# EAGLE design SOIL (EAGLE 9.6.2)
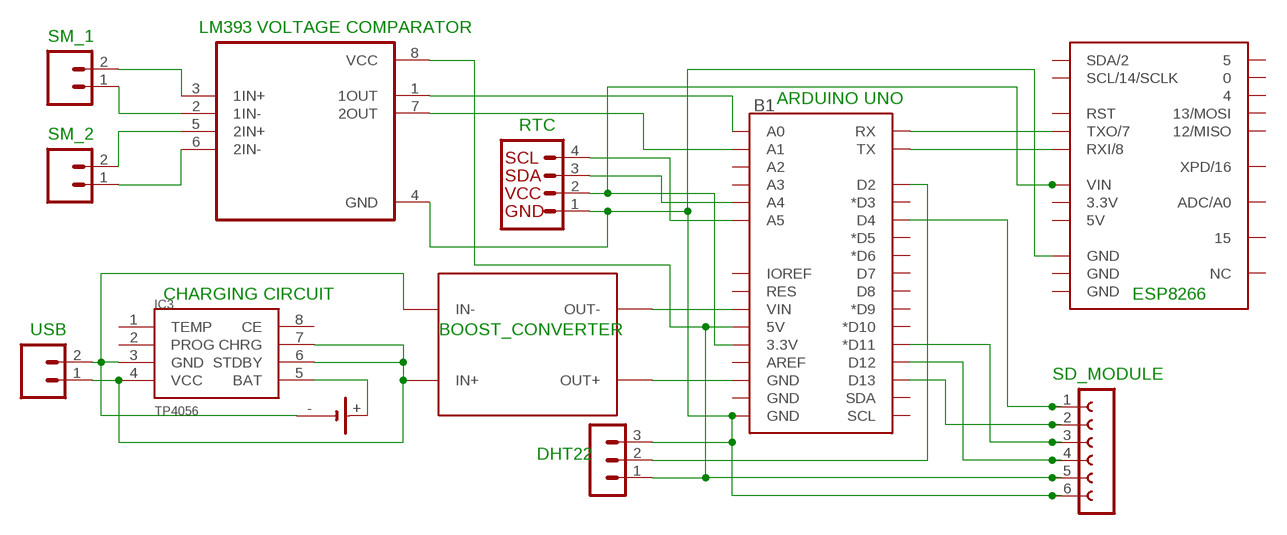
[diagram p0: schematic, sheet 1]

## Parts
B1  ARDUINO_UNO_R3_SHIELDUNO_R3_SHIELD_NOLABELS_LOCK  [UNO_R3_SHIELD_NOLABELS_LOCK]
B2  SPARKFUN_ESP8266_THING_DEV  [SPARKFUN_ESP8266_THING_DEV]
G1  SL-150-1/2AA/PT  [SL-150-1/2AA/PT]
IC3  TP4056  [SOP-8]
J3  CONN_02  [1X02]
J4  I2C_STANDARDUNITEST  [1X04_UNITEST]
J5  CONN_02  [1X02]
J6  CONN_02  [1X02]
SV3  MA03-1  [MA03-1]
SV4  FE06-1  [FE06]
U1  LM393D  [SOIC127P600X175-8N]
U$1  DC-DC-STEP-UP-MT3608  [DC-DC-STEP-UP-MT3608]

## Nets
N$1: B1.VIN U$1.OUT-
N$2: B1.GND@2(GND) U$1.OUT+
N$3: G1.- IC3.3(GND) J5.2 U$1.IN-
N$4: IC3.4(VCC) IC3.6(STDBY) IC3.7(CHRG) J5.1 U$1.IN+
N$5: G1.+ IC3.5(BAT)
N$6: J6.2 U1.3(1IN+)
N$7: B1.D4 SV4.1
N$8: B1.D13 SV4.2
N$9: B1.D11(*D11) SV4.3
N$10: B1.D12 SV4.4
N$11: B1.5V SV3.1 SV4.5 U1.8(VCC)
N$12: B1.GND@0(GND) B2.GND@1(GND) J4.1 SV3.3 SV4.6 U1.4(GND)
N$13: B1.A5 J4.4
N$14: B1.A4 J4.3
N$15: B1.3.3V B2.VIN J4.2
N$16: B1.RX B2.TX(TXO/7)
N$17: B1.TX B2.RX(RXI/8)
N$18: B1.D2 SV3.2
N$19: J6.1 U1.2(1IN-)
N$20: B1.A1 U1.7(2OUT)
N$21: B1.A0 U1.1(1OUT)
N$22: J3.2 U1.5(2IN+)
N$23: J3.1 U1.6(2IN-)
Unconnected: B1.A2 B1.A3 B1.AREF B1.D3(*D3) B1.D5(*D5) B1.D6(*D6) B1.D7 B1.D8 B1.D9(*D9) B1.D10(*D10) B1.GND@1(GND) B1.IOREF B1.RES B1.SCL B1.SDA B2.0 B2.2(SDA/2) B2.4 B2.5 B2.12(12/MISO) B2.13(13/MOSI) B2.14(SCL/14/SCLK) B2.15 B2.16(XPD/16) B2.ADC(ADC/A0) B2.NC B2.RST G1.-@1(-) IC3.1(TEMP) IC3.2(PROG) IC3.8(CE)

## Notes on the sheet
- LM393 VOLTAGE COMPARATOR
- SM_1
- ARDUINO UNO
- RTC
- SM_2
- CHARGING CIRCUIT | ESP8266
- USB | BOOST_CONVERTER
- SD_MODULE
- DHT22

## Power pins joined to a net without a drawn wire
3.3V: B2.3.3V
5V: B2.5V
GND: B2.GND@2(GND) B2.GND@3(GND)

## Library data of the parts
B1 = SparkFun-Boards:ARDUINO_UNO_R3_SHIELD: Arduino R3 Shield Footprint Shield form compatible with the Arduino Uno R3. SparkFun Products: MG2639 Cellular Shield <https://www.sparkfun.com/products/13120> MIDI Shield <https://www.sparkfun.com/products/12898> R3 Stackable Headers Kit <https://www.sparkfun.com/products/11417>
B2 = SparkFun-Boards:SPARKFUN_ESP8266_THING_DEV: SparkFun Thing -Dev Board The SparkFun ESP8266 Thing Dev is a breakout and development board for the ESP8266 WiFi SoC, with an integrated FTDI USB-to-Serial chip. SparkFun Products: SparkFun ESP8266 Thing-Dev Board <https://www.sparkfun.com/products/13711>; SF_ID: WRL-13711
G1 = battery:SL-150-1/2AA/PT: LI BATTERY Sonnenschein
IC3 = TP4056:TP4056
J3 J5 J6 = SparkFun-Connectors:CONN_02: Multi connection point. Often used as Generic Header-pin footprint for 0.1 inch spaced/style header connections On any of the 0.1 inch spaced packages, you can populate with these: Break Away Headers - Straight <https://www.sparkfun.com/products/116> (PRT-00116) Break Away Male Headers - Right Angle <https://www.sparkfun.com/products/553> (PRT-00553) Female Headers <https://www.sparkfun.com/products/115> (PRT-00115) Break Away Headers - Machine Pin <https://www.sparkfun.com/products/117> (PRT-00117) Break Away Female Headers - Swiss Machine Pin <https://www.sparkfun.com/products/743> (PRT-00743) For SCREWTERMINALS and SPRING TERMINALS visit here: Screw Terimnals on SparkFun.com <https://www.sparkfun.com/search/results?term=Screw+Terminals> (5mm/3.5mm/2.54mm spacing) This device is also useful as a general connection point to wire up your design to another part of your project. Our various solder wires solder well into these plated through hole pads. Hook-Up Wire - Assortment (Stranded, 22 AWG) <https://www.sparkfun.com/products/11375> (PRT-11375) Hook-Up Wire - Assortment (Solid Core, 22 AWG) <https://www.sparkfun.com/products/11367> (PRT-11367) View the entire wire category on our website here <https://www.sparkfun.com/categories/141> Special notes: Molex polarized connector foot print use with: PRT-08233 with associated crimp pins and housings. 2.54_SCREWTERM for use with PRT-10571. 3.5mm Screw Terminal footprints for PRT-08084 5mm Screw Terminal footprints for use with PRT-08432
J4 = SparkFun-Connectors:I2C_STANDARD: SparkFun I2C Standard Pinout Header SparkFun has standardized on a pinout for all I2C based sensor breakouts. This pinout allows I2C boards to be plugged directly into the headers on Arduino Uno compatible boards, and to be daisy chained easily. Example SparkFun Products: SparkFun Atmospheric Sensor Breakout - BME280 <https://www.sparkfun.com/products/13676> SparkFun Altitude/Pressure Sensor Breakout - MPL3115A2 <https://www.sparkfun.com/products/11084> SparkFun TOF Range Finder Sensor - VL6180 <https://www.sparkfun.com/products/12785>
SV3 = con-lstb:MA03-1: PIN HEADER; OC_FARNELL: unknown; OC_NEWARK: unknown
SV4 = con-lsta:FE06-1: FEMALE HEADER; OC_FARNELL: unknown; OC_NEWARK: unknown
U1 = LM393D:LM393D: Check availability <https://pricing.snapeda.com/parts/LM393D/STMicroelectronics/view-part?ref=eda>; AVAILABILITY: In Stock; DESCRIPTION: Comparator General Purpose CMOS, DTL, ECL, MOS, Open-Collector, TTL 8-SOIC; MF: STMicroelectronics; MP: LM393D; PACKAGE: SOIC-8 STMicroelectronics; PRICE: None; PURCHASE-URL: https://pricing.snapeda.com/search/part/LM393D/?ref=eda
U$1 = dc-dc-boost-2a-microusb-mt3608:DC-DC-STEP-UP-MT3608: DC/DC Step-Up Regulator based on MT3608 chip MT3608 datasheet available here: https://www.olimex.com/Products/Breadboarding/BB-PWR-3608/resources/MT3608.pdf Click here to find device on ebay.com <http://www.ebay.com/sch/mt3608+module>

## Board
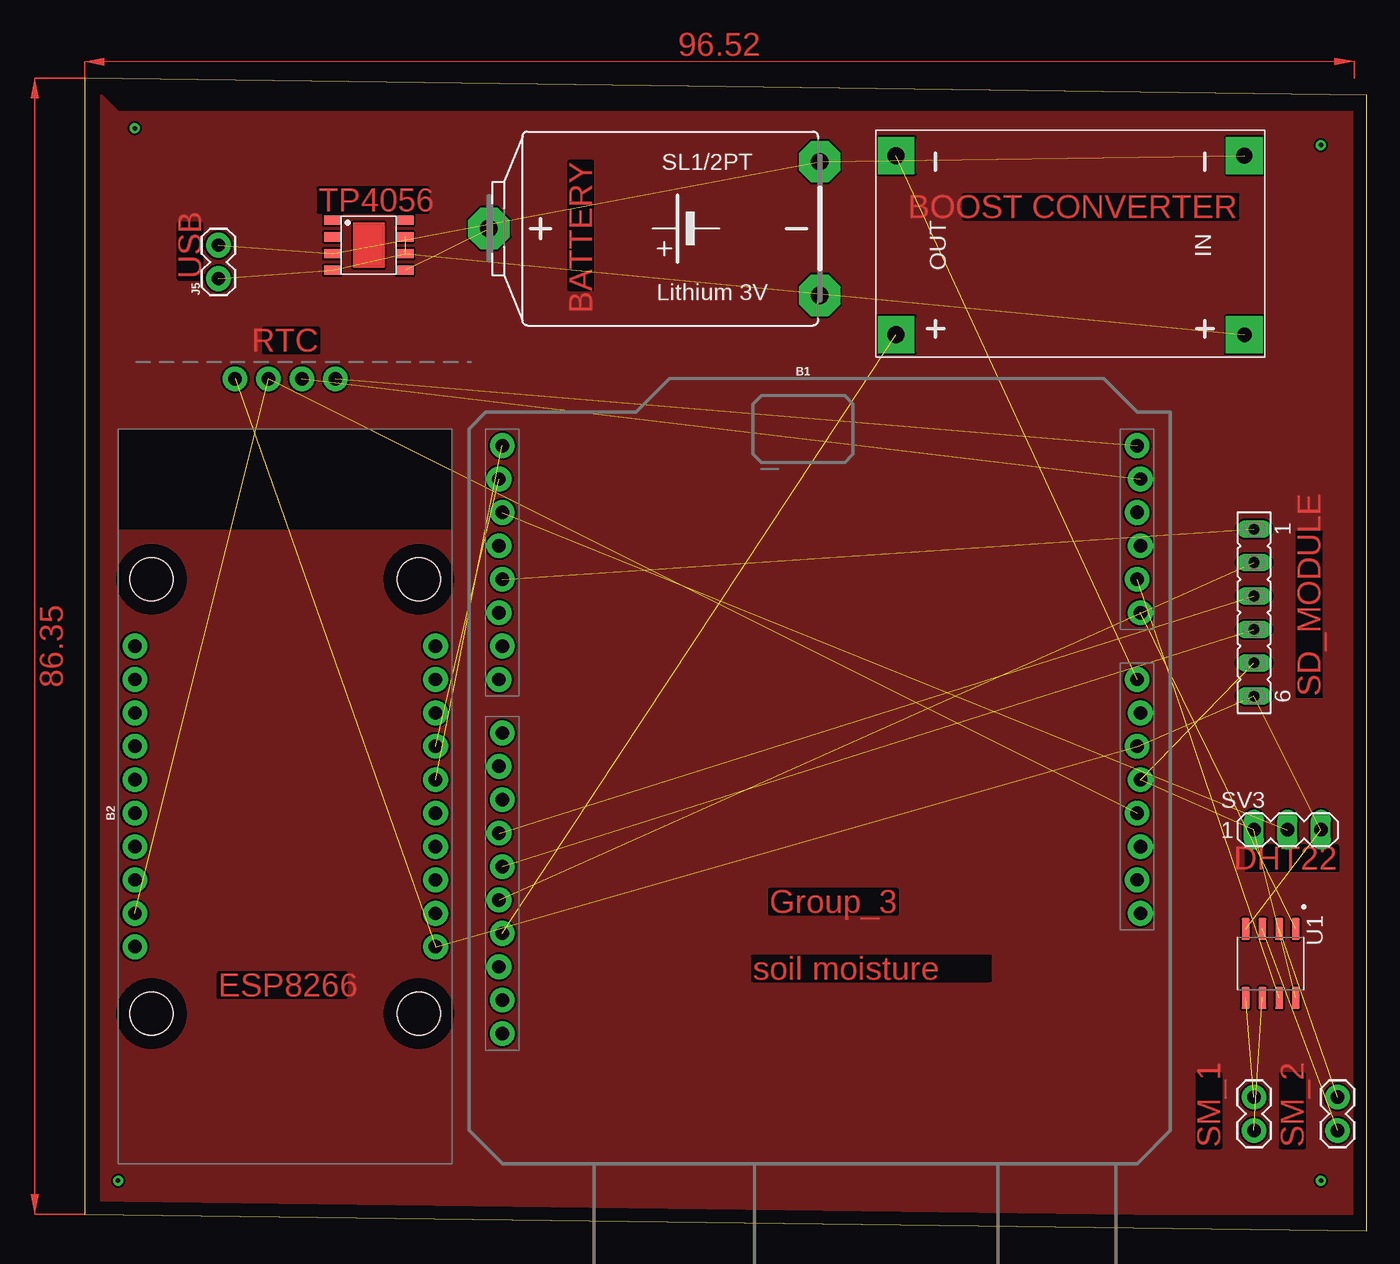
[diagram p1: board, top side]
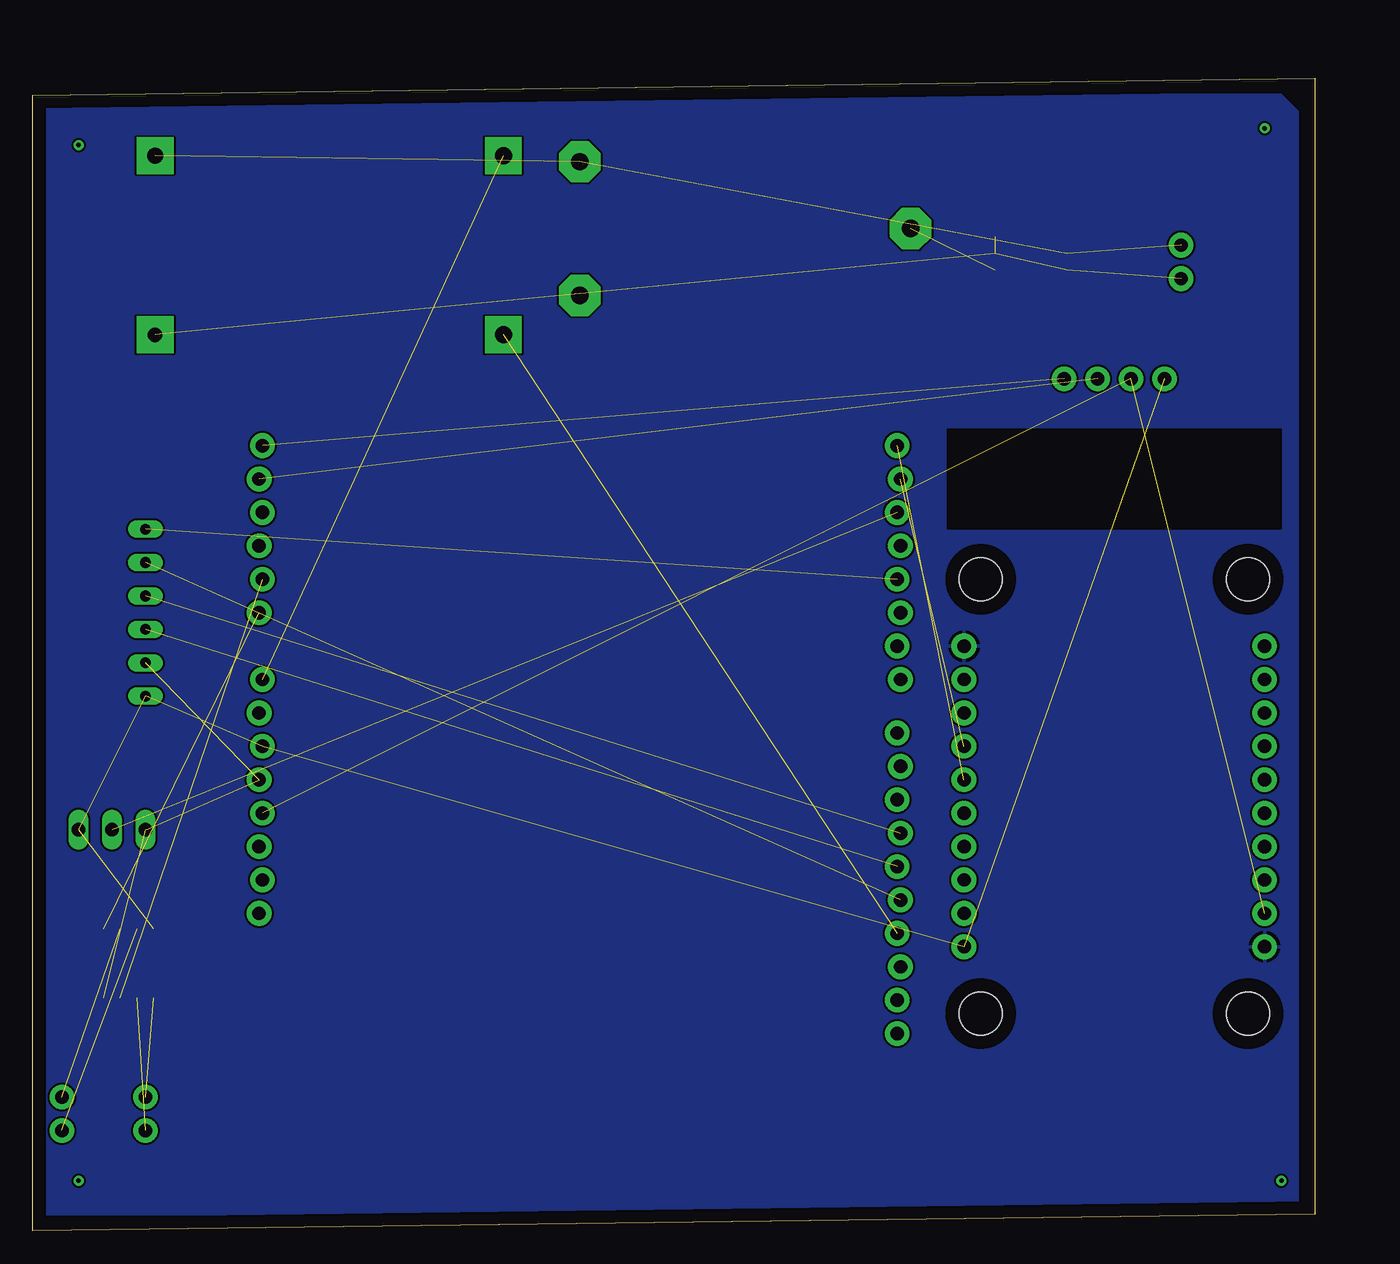
[diagram p2: board, bottom side, seen from below]

Size 97.46 x 87.62 mm. Coordinates in mm from the lower left corner, seen from the top.
Outline: 0,1.27 97.46,0 97.46,86.35 0,87.62 0,1.27
Copper layers (1*16): Top 0.035mm / dielectric 1.5mm / Bottom 0.035mm
Design rules "default": minimum track width 6mil, minimum drill 0.35mm, track to track 6mil, track to pad 6mil, pad to pad 6mil, via to via 6mil, smd to smd 6mil, copper to edge 40mil, drill to drill 6mil, minimum pad ring 10mil, minimum via ring 8mil, stop-mask expansion 4mil, vias tented up to drill 0mil, thermal gap 10mil

### Footprints (pad centres in the part's own frame; a part is rotated, then mirrored left to right if it is on the bottom)
UNO_R3_SHIELD_NOLABELS_LOCK = drill 1.016 pad 1.88: 3.3V 24.13,-3.81; 5V 24.384,-1.27; A0 24.384,11.43; A1 24.13,13.97; A2 24.384,16.51; A3 24.13,19.05; A4 24.384,21.59; A5 24.13,24.13; AREF -24.384,-15.494; D2 -24.13,19.05; D3 -24.384,16.51; D4 -24.13,13.97; D5 -24.384,11.43; D6 -24.13,8.89; D7 -24.384,6.35; D8 -24.13,2.286; D9 -24.384,-0.254; D10 -24.13,-2.794; D11 -24.384,-5.334; D12 -24.13,-7.874; D13 -24.384,-10.414; GND@0 24.13,1.27; GND@1 24.384,3.81; GND@2 -24.13,-12.954; IOREF 24.13,-8.89; NC 24.384,-11.43; RES 24.384,-6.35; RX -24.13,24.13; SCL -24.13,-20.574; SDA -24.13,-18.034; TX -24.384,21.59; VIN 24.13,6.35
SPARKFUN_ESP8266_THING_DEV = drill 1.016 pad 1.88: 0 -2.54,11.43; 2 -5.08,-11.43; 3.3V -7.62,-11.43; 4 0,11.43; 5 -5.08,11.43; 5V 7.62,-11.43; 12 5.08,11.43; 13 2.54,11.43; 14 -2.54,-11.43; 15 12.7,11.43; 16 7.62,11.43; ADC 10.16,11.43; GND@1 -10.16,-11.43; GND@2 12.7,-11.43; GND@3 -10.16,11.43; NC 10.16,-11.43; RST 0,-11.43; RX 5.08,-11.43; TX 2.54,-11.43; VIN -7.62,11.43 | hole 3.302: -15.24,-10.16; -15.24,10.16; 17.78,10.16; 17.78,-10.16
SL-150-1/2AA/PT = drill 1.321 pad 3.15 octagon: + 12.446,0; - -12.7,-5.08; -@1 -12.7,5.08
SOP-8 = smd 1.3 x 0.7: 1 -2.75,1.905; 2 -2.75,0.635; 3 -2.75,-0.635; 4 -2.75,-1.905; 5 2.75,-1.905; 6 2.75,-0.635; 7 2.75,0.635; 8 2.75,1.905
1X02 = drill 1.016 pad 1.88: 1 0,0; 2 2.54,0
1X04_UNITEST = drill 1.016 pad 1.88: 1 2.54,2.54; 2 5.08,2.54; 3 7.62,2.54; 4 10.16,2.54
MA03-1 = drill 1.016 long: 1 -2.54,0; 2 0,0; 3 2.54,0
FE06 = drill 0.813 long: 1 -6.35,0; 2 -3.81,0; 3 -1.27,0; 4 1.27,0; 5 3.81,0; 6 6.35,0
SOIC127P600X175-8N = smd 1.67 x 0.6: 1 -2.625,1.905; 2 -2.625,0.635; 3 -2.625,-0.635; 4 -2.625,-1.905; 5 2.625,-1.905; 6 2.625,-0.635; 7 2.625,0.635; 8 2.625,1.905
DC-DC-STEP-UP-MT3608 = drill 1.1 pad 2.8 square: IN+ -13.24,6.81 | drill 1.2 pad 2.8 square: IN- -13.24,-6.81 | drill 1.3 pad 2.8 square: OUT+ 13.24,6.81; OUT- 13.24,-6.81

### Placement (x,y rotation side)
B1  55.88,35.56 0 top
B2  15.24,31.75 90 top
G1  43.18,76.2 180 top
IC3  21.59,74.93 0 top
J3  88.9,7.62 90 top
J4  8.89,62.23 0 top
J5  10.16,72.39 90 top
J6  95.25,10.16 270 top
SV3  91.44,30.48 0 top
SV4  88.9,46.99 270 top
U1  90.17,20.32 270 top
U$1  74.93,74.93 180 top

### Tracks (layer width: path | path; a pad name or v marks a point on that pad's centre or on a via)
GND
  pour Bottom: 2.54,86.36 96.52,86.36 97.79,85.09 97.79,2.54 96.52,1.27 1.27,1.27 1.27,85.09
N$1  (1 unrouted)
N$2  (1 unrouted)
N$3  (3 unrouted)
N$4  (4 unrouted)
N$5  (1 unrouted)
N$6  (1 unrouted)
N$7  (1 unrouted)
N$8  (1 unrouted)
N$9  (1 unrouted)
N$10  (1 unrouted)
N$11  (3 unrouted)
N$12  (5 unrouted)
N$13  (1 unrouted)
N$14  (1 unrouted)
N$15  (2 unrouted)
N$16  (1 unrouted)
N$17  (1 unrouted)
N$18  (1 unrouted)
N$19  (1 unrouted)
N$20  (1 unrouted)
N$21  (1 unrouted)
N$22  (1 unrouted)
N$23  (1 unrouted)
N$24  (via drill 0.35)
  other vias: 3.81,83.82
N$25  (via drill 0.35)
  other vias: 93.98,82.55
N$26  (via drill 0.35)
  other vias: 93.98,3.81
N$27  (via drill 0.35)
  other vias: 2.54,3.81
VCC
  pour Top: 1.27,86.36 2.54,85.09 96.52,85.09 96.52,1.27 1.27,1.27
(copper drawn outside any net)
  shapes: Top area x2

### Text on the board
Top: BATTERY | BOOST CONVERTER | TP4056 | USB | RTC | SD_MODULE | DHT22 | Group_3 | soil moisture | ESP8266 | SM_1 | SM_2